# Altium schematic sheet Pherips.SchDoc
size A4
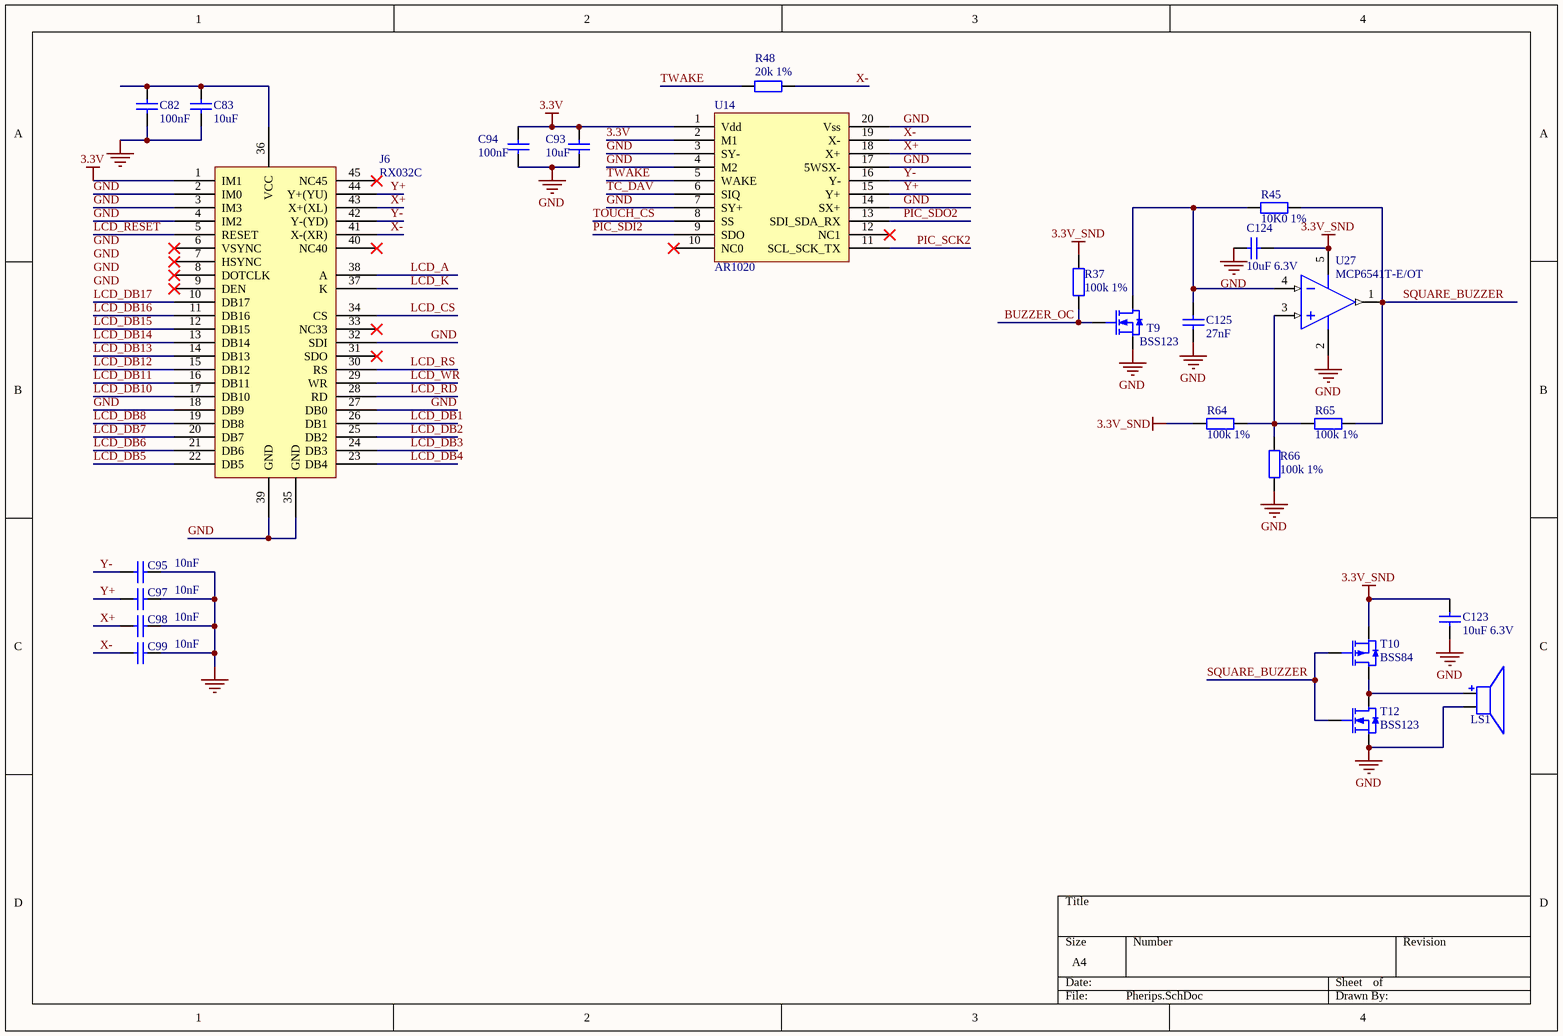
[diagram p0: Pherips.SchDoc]

## Parts
C82  value 100nF  [0603]  (hidden comment: Cap)
C83  value 10uF  [0805]  (hidden comment: Cap)
C93  value 10uF  [0805]  (hidden comment: Cap)
C94  value 100nF  [0603]  (hidden comment: Cap)
C95  value 10nF  [0603]  (hidden comment: Cap)
C97  value 10nF  [0603]  (hidden comment: Cap)
C98  value 10nF  [0603]  (hidden comment: Cap)
C99  value 10nF  [0603]  (hidden comment: Cap)
C123  value 10uF 6.3V  [0805]  (hidden comment: Cap)
C124  value 10uF 6.3V  [0805]  (hidden comment: Cap)
C125  value 27nF  [0603]  (hidden comment: Cap)
J6  RX032C  [FCI-62684-45210E9ALF-FPC_FFC_BOTTOM]
LS1  Buzzer  [BUZZER_65_45]  (value not drawn)
R37  value 100k 1%  [0603]  (hidden comment: Res)
R45  value 10K0 1%  [0603]  (hidden comment: Res2)
R48  value 20k 1%  [0603]
R64  value 100k 1%  [0603]  (hidden comment: Res)
R65  value 100k 1%  [0603]  (hidden comment: Res)
R66  value 100k 1%  [0603]  (hidden comment: Res)
T9  BSS123  [SOT23]
T10  BSS84  [SOT23]
T12  BSS123  [SOT23]
U14  AR1020  [SSOP20]
U27  MCP6541T-E/OT  [SOT-23-OT5_N]

## Nets
3.3V: C93.2 C94.2 J6.1(IM1) U14.1(Vdd) U14.2(M1)
3.3V_SND: C123.2 C124.2 R37.1 R64.2 T10.2(S) U27.5(VDD)
GND: C82.1 C83.1 C93.1 C94.1 C95.2 C97.2 C98.2 C99.2 C123.1 C124.1 C125.1 J6.2(IM0) J6.3(IM3) J6.4(IM2) J6.18(DB9) J6.27(DB0) J6.32(SDI) J6.35(GND) J6.39(GND) LS1.2 R66.2 T9.2(S) T12.2(S) U14.3(SY-) U14.4(M2) U14.7(SY+) U14.14(SX+) U14.17(5WSX-) U14.20(Vss) U27.2(VSS)
BUZZER_OC: R37.2 T9.1(G)
LCD_A: J6.38(A)
LCD_CS: J6.34(CS)
LCD_DB1: J6.26(DB1)
LCD_DB2: J6.25(DB2)
LCD_DB3: J6.24(DB3)
LCD_DB4: J6.23(DB4)
LCD_DB5: J6.22(DB5)
LCD_DB6: J6.21(DB6)
LCD_DB7: J6.20(DB7)
LCD_DB8: J6.19(DB8)
LCD_DB10: J6.17(DB10)
LCD_DB11: J6.16(DB11)
LCD_DB12: J6.15(DB12)
LCD_DB13: J6.14(DB13)
LCD_DB14: J6.13(DB14)
LCD_DB15: J6.12(DB15)
LCD_DB16: J6.11(DB16)
LCD_DB17: J6.10(DB17)
LCD_K: J6.37(K)
LCD_RD: J6.28(RD)
LCD_RESET: J6.5(RESET)
LCD_RS: J6.30(RS)
LCD_WR: J6.29(WR)
PIC_SCK2: U14.11(SCL_SCK_TX)
PIC_SDI2: U14.9(SDO)
PIC_SDO2: U14.13(SDI_SDA_RX)
SQUARE_BUZZER: R45.1 R65.2 T10.1(G) T12.1(G) U27.1(OUT)
TC_DAV: U14.6(SIQ)
TOUCH_CS: U14.8(SS)
TWAKE: R48.2 U14.5(WAKE)
X+: C98.1 J6.43(X+(XL)) U14.18(X+)
X-: C99.1 J6.41(X-(XR)) R48.1 U14.19(X-)
Y+: C97.1 J6.44(Y+(YU)) U14.15(Y+)
Y-: C95.1 J6.42(Y-(YD)) U14.16(Y-)
NetC82_2: C82.2 C83.2 J6.36(VCC)
NetC125_2: C125.2 R45.2 T9.3(D) U27.4(VIN-)
NetLS1_1: LS1.1 T10.3(D) T12.3(D)
NetR64_1: R64.1 R65.1 R66.1 U27.3(VIN+)

Not connected (* = marked no-connect by the designer): J6 6(VSYNC)* 7(HSYNC)* 8(DOTCLK)* 9(DEN)* 31(SDO)* 33(NC33)* 40(NC40)* 45(NC45)*; U14 10(NC0)* 12(NC1)*

## Notes on the sheet
- Labels drawn without touching a wire or pin: GND

## Library data of the parts
C82 C83 C93-C95 C97-C99 = Cap: Capacitor; Distributor: Lomex
  C82 C94: Order ID: 82-04-85; Price: 0.35
  C83 C93: Order ID: 82-05-94; Price: 5.7
  C95 C97-C99: Order ID: 82-06-12; Price: 0.40
C123 C124 = Cap: 10uF 0805 10% 6.3V X5R CC0805KKX5R5BB106 (YAG) RoHS; Distributor: Lomex; Order ID: 82-05-94; Price: 4.80
C125 = Cap: 100pF 0603 5% 50V NP0 CC0603JRNP09BN101 (YAG) RoHS; Distributor: Lomex; Order ID: 82-04-04; Price: 1.2
J6 = RX032C: Order ID: 1830641; Value: FCI - 62684-45110E9ALF - FPC/FFC; Distributor: Farnell; Price: 213
LS1 = Buzzer: Speaker connector.; Distributor: Lomex; Value: Buzzer; Price: 178; Order ID: 46-02-20
R37 R48 R64-R66 = Res: Resistor; Distributor: Lomex; Price: 0.33
  R37 R64-R66: Order ID: 80-03-94
  R48: ORDER ID: 80-14-52
R45 = Res2: 10K0 0603 1% CR-03FL7---10K 0.1W (TCL) RoHS; Order ID: 80-11-68; Distributor: Lomex; Price: 0.24
T9 T12 = BSS123: N-Channel MOSFET; Price: 7.2; Distributor: Lomex; Order ID: 86-03-28; Value: BSS123
T10 = BSS84: N-Channel MOSFET; Value: BSS84; Distributor: Lomex; Order ID: 86-03-27; Price: 7.9
U14 = AR1020: 4 wire resistive sensor driver.; Order ID: AR1020-I/SS; SR: RS; Distributor: Chipcad; Price: 330; Value: AR1020
U27 = MCP6541T-E/OT: Push-Pull Output Sub-Microamp Comparator, 5-Pin SOT-23, Extended Temperature, Tape and Reel; Order ID: MCP6541T-E/OT; Distributor: ChipCAD; Price: 70.00; Value: MCP6541T-E/OT